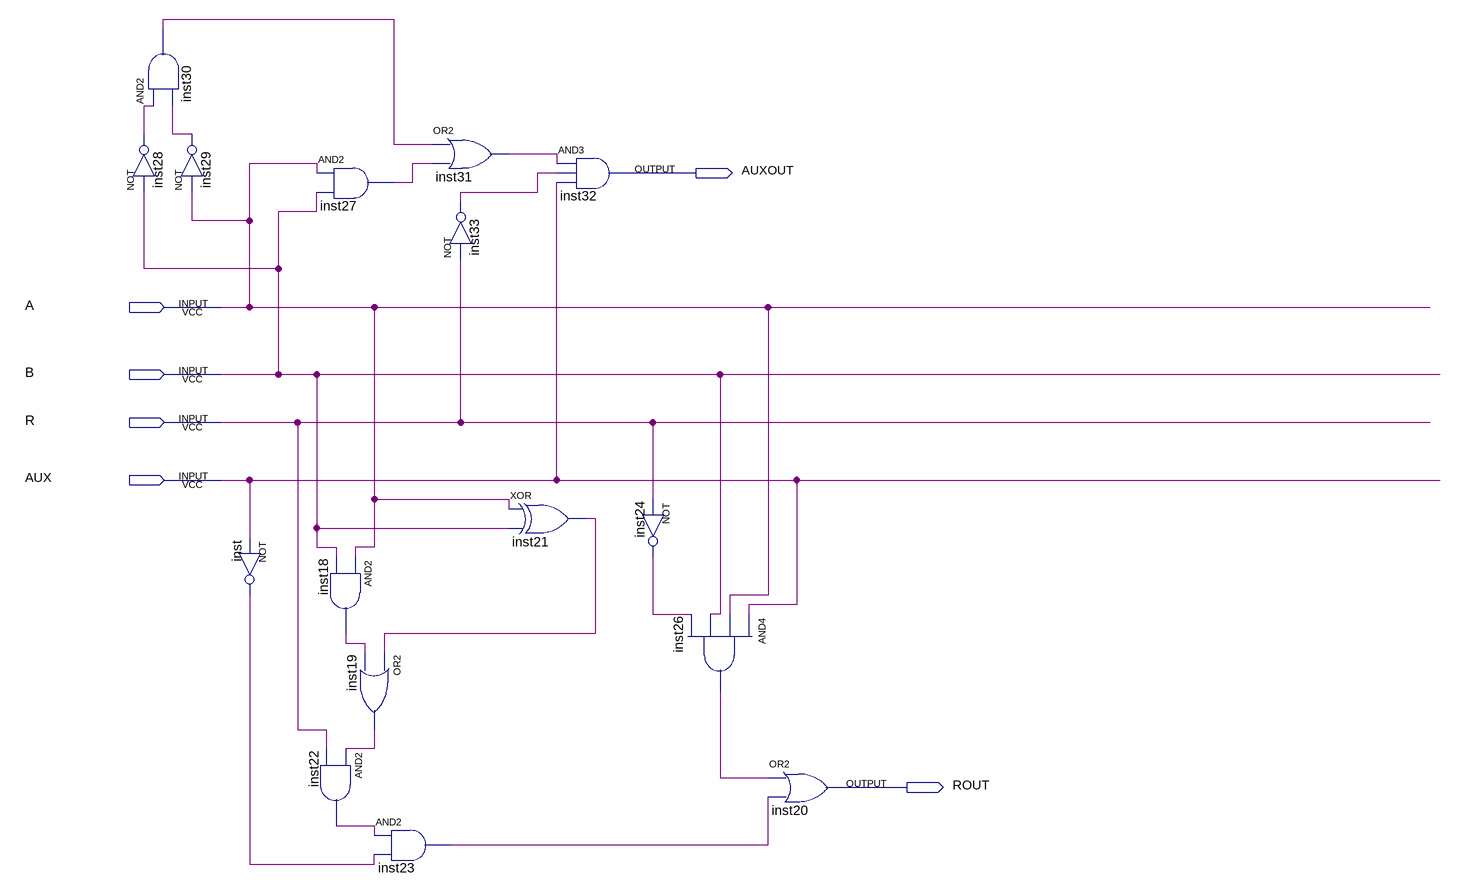
[diagram p0: schematic sheet]
// Quartus schematic MaiorMenorGenericBlock.bdf as structural Verilog: 16 symbols, 6 pins
module MaiorMenorGenericBlock (
  input  A,
  input  B,
  input  R,
  input  AUX,
  output AUXOUT,
  output ROUT
);

  wire inst18_out, inst19_out, inst21_out, inst22_out, inst23_out, inst24_out, inst26_out, inst27_out,
       inst28_out, inst29_out, inst30_out, inst31_out, inst33_out, inst_out;

  and inst30 (inst30_out, inst28_out, inst29_out);
  not inst28 (inst28_out, B);
  not inst29 (inst29_out, A);
  not inst (inst_out, AUX);
  and inst22 (inst22_out, inst19_out, R);
  and inst27 (inst27_out, A, B);
  and inst18 (inst18_out, A, B);
  or inst19 (inst19_out, inst21_out, inst18_out);
  and inst23 (inst23_out, inst22_out, inst_out);
  or inst31 (inst31_out, inst30_out, inst27_out);
  not inst33 (inst33_out, R);
  xor inst21 (inst21_out, A, B);
  and inst32 (AUXOUT, inst31_out, inst33_out, AUX);
  not inst24 (inst24_out, R);
  and inst26 (inst26_out, AUX, A, B, inst24_out);
  or inst20 (ROUT, inst26_out, inst23_out);
endmodule
